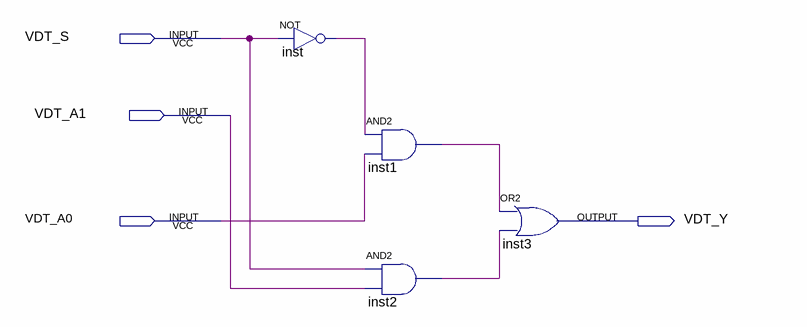
[diagram p0: schematic sheet]
// Quartus schematic assignment4.bdf as structural Verilog: 4 symbols, 4 pins
module assignment4 (
  input  VDT_S,
  input  VDT_A1,
  input  VDT_A0,
  output VDT_Y
);

  wire inst1_out, inst2_out, inst_out;

  not inst (inst_out, VDT_S);
  and inst1 (inst1_out, inst_out, VDT_A0);
  and inst2 (inst2_out, VDT_S, VDT_A1);
  or inst3 (VDT_Y, inst1_out, inst2_out);
endmodule
